# EAGLE schematic LabAccessBoard (EAGLE 9.0.1)
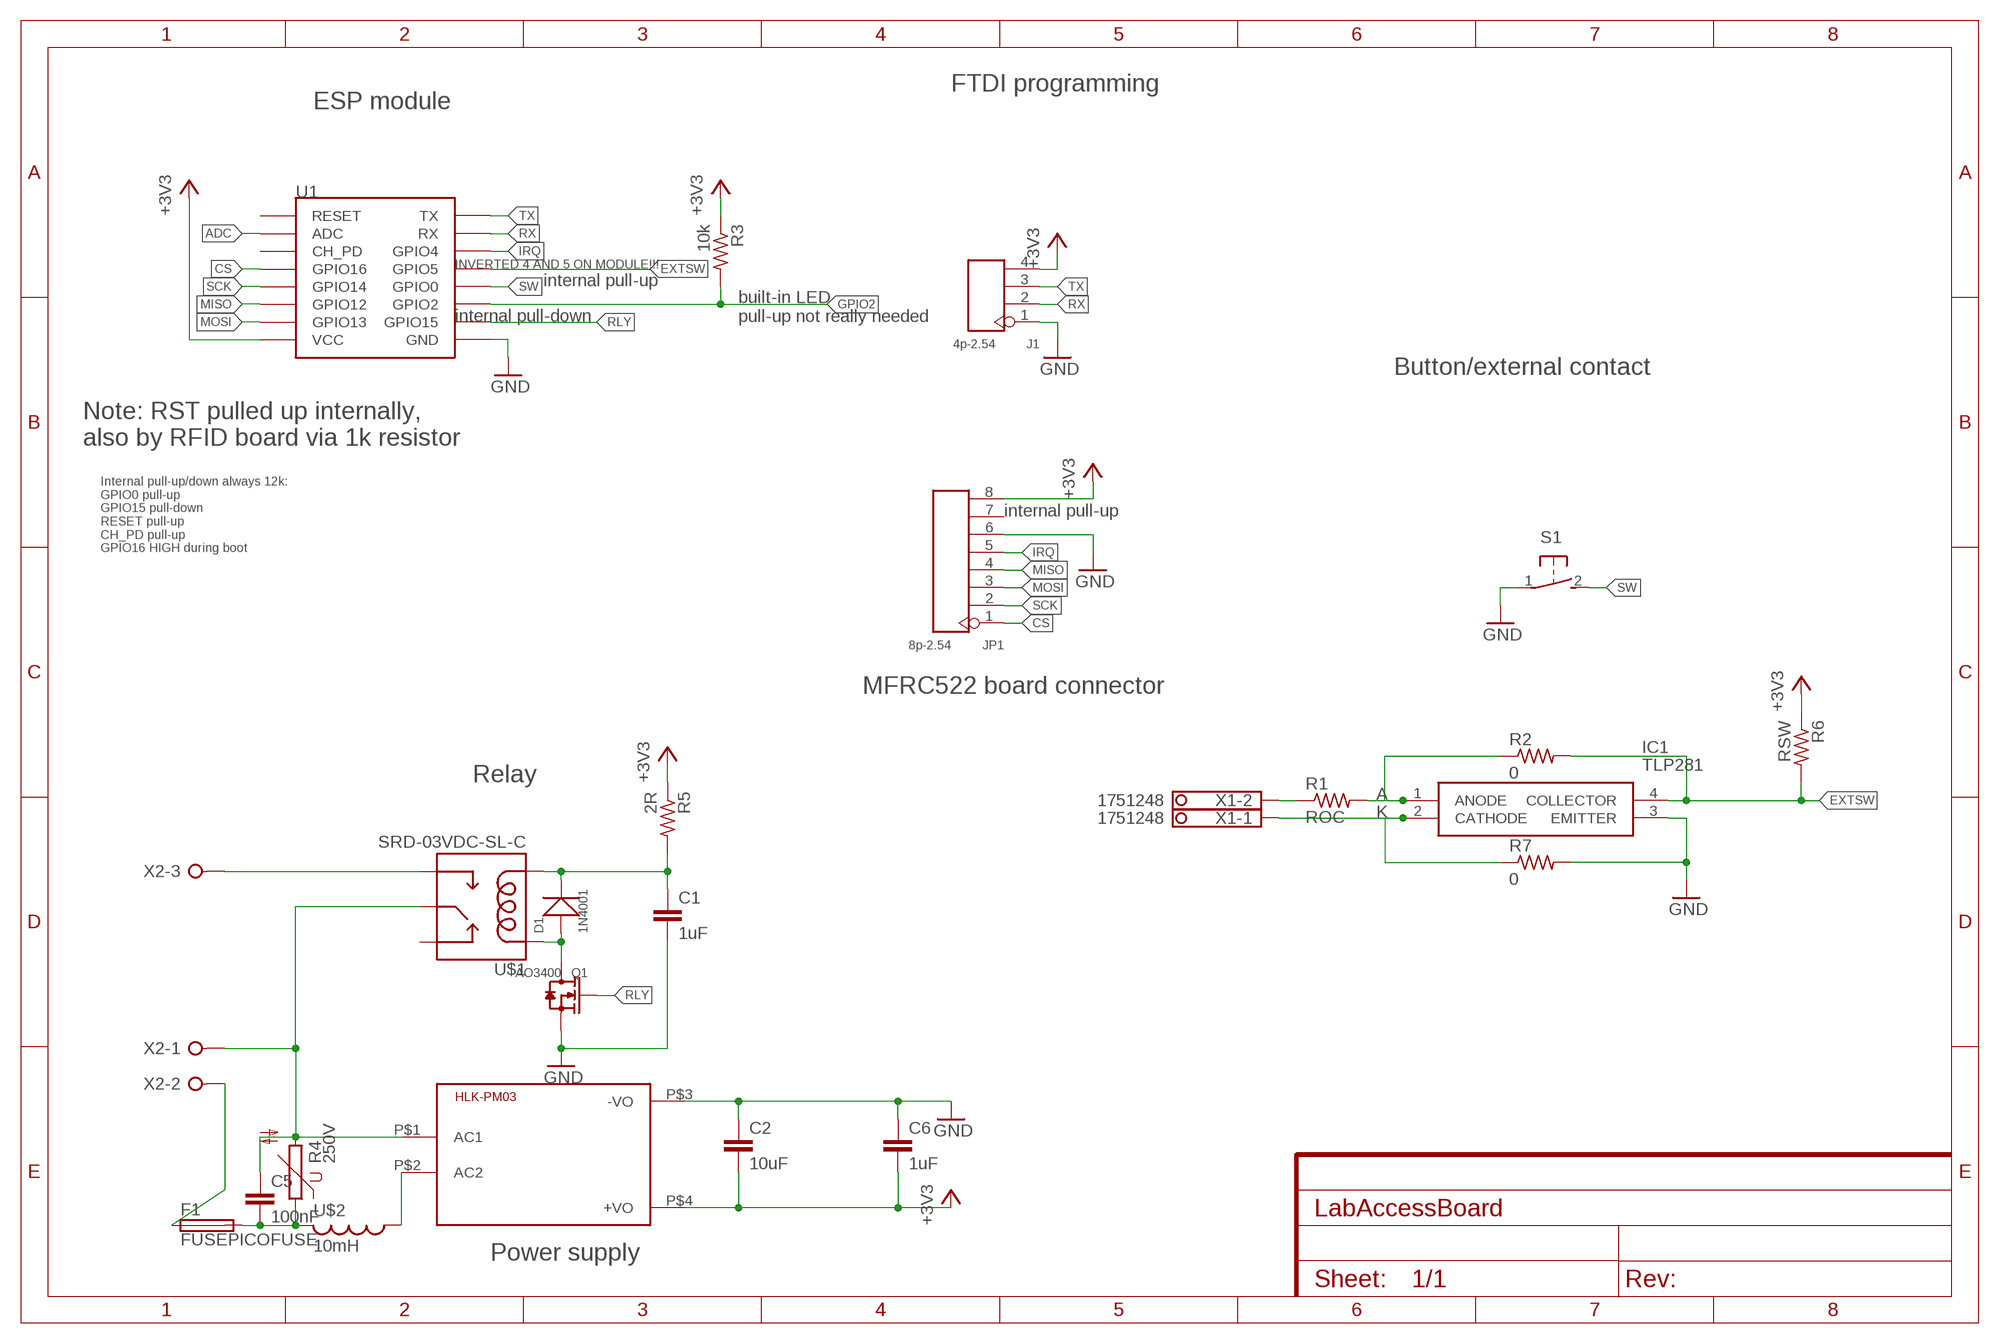
[diagram p0: schematic, sheet 1]

## Parts
C1  1uF  C-EUC0603K  [C0603K]
C2  10uF  C-EUC0805K  [C0805K]
C5  100nF  C-EU102-064X133  [C102-064X133]
C6  1uF  C-EUC0603K  [C0603K]
D1  1N4001  DIODE-GEN-PURPOSE-1KV-1A(DO-214AC)  [DO-214AC]
F1  FUSEPICOFUSE  [PICOFUSE]
HLK-PM03  HLK-PM03  HLK-PM013W  [HLK-PM01]
IC1  TLP281  TLP281(GB-TP,F)  [SOIC127P700X190-4N]
J1  4p-2.54  DIP-BLACK-MALE-HEADER-VERT(4P-2.54)  [H4-2.54]
JP1  8p-2.54  DIP-BLACK-MALE-HEADER-VERT(8P-2.54)  [H8-2.54]
Q1  AO3400  SMD-MOSFET-N-CH-60V-300MA-LOGIC-LEVEL-FET-2N7002(SOT-23)  [SOT-23]
R1  ROC  R-US_R0603  [R0603]
R2  0  R-US_R0603  [R0603]
R3  10k  R-US_R0603  [R0603]
R4  250V  S07K250  [S07K250]
R5  2R  R-US_R0603  [R0603]
R6  RSW  R-US_R0603  [R0603]
R7  0  R-US_R0603  [R0603]
S1  31-XX  [B3F-31XX]
U1  ESP12SMD  [ESP12-SMD]
U$1  SRD-03VDC-SL-C  SRD-0XVDC-SL-CSRD-06VDC-SL-C  [SRD-0XVDC-SL-C]
U$2  10mH  L-US6000-XXX-RC  [6000-XXXX-RC]
X1  1751248  [1751248]
X2  W237-3E  [W237-3E]

## Nets
+3V3: C2.2 C6.2 HLK-PM03.P$4(+VO) J1.4 JP1.8 R3.1 R5.1 R6.1 U1.VCC
A: IC1.1(ANODE) R1.2 R2.1
ADC: U1.ADC
CS: JP1.1 U1.GPIO16
EXTSW: IC1.4(COLLECTOR) R2.2 R6.2 U1.GPIO5
GND: C1.2 C2.1 C6.1 HLK-PM03.P$3(-VO) IC1.3(EMITTER) J1.1 JP1.6 Q1.2(S) R7.2 S1.1(P) U1.GND
GPIO2: R3.2 U1.GPIO2
IRQ: JP1.5 U1.GPIO4
K: IC1.2(CATHODE) R7.1 X1.1
MISO: JP1.4 U1.GPIO12
MOSI: JP1.3 U1.GPIO13
N$1: U$1.SWOPEN X2.3
N$2: C5.1 HLK-PM03.P$1(AC1) R4.2 U$1.SWCOMMON X2.1
N$3: C5.2 F1.2 R4.1 U$2.2
N$4: F1.1 X2.2
N$5: C1.1 D1.2(-) R5.2 U$1.COIL0
N$6: HLK-PM03.P$2(AC2) U$2.1
N$8: D1.1(+) Q1.3(D) U$1.COIL1
N$9: R1.1 X1.2
RLY: Q1.1(G) U1.GPIO15
RX: J1.2 U1.RXD0(RX)
SCK: JP1.2 U1.GPIO14
SW: S1.2(S) U1.GPIO0
TX: J1.3 U1.TXD0(TX)
Unconnected: JP1.7 U1.CH_PD U1.RESET U$1.SWCLOSED(SWCLOSE)

## Notes on the sheet
- FTDI programming
- ESP module
- INVERTED 4 AND 5 ON MODULE!!!
- internal pull-up
- internal pull-down
- built-in LED
  pull-up not really needed
- Button/external contact
- Note: RST pulled up internally,
  also by RFID board via 1k resistor
- internal pull-up
- Internal pull-up/down always 12k:
  GPIO0 pull-up
  GPIO15 pull-down
  RESET pull-up
  CH_PD pull-up
  GPIO16 HIGH during boot
- MFRC522 board connector
- Relay
- Power supply

## Library data of the parts
C1 C2 C5 C6 = rcl:C-EU: CAPACITOR, European symbol; SPICEPREFIX: C
D1 = Seeed-Diode:DIODE-GEN-PURPOSE-1KV-1A(DO-214AC): 304010013; MPN: 1N4007; VALUE: 1N4007
F1 = fuse:FUSE: Fuse; OC_FARNELL: unknown; OC_NEWARK: unknown
HLK-PM03 = HLK-PM01:HLK-PM01: Hi-Link Power Supply HLK-PM01 3W Author: Ahmed Said <https://github.com/AhmedSaid/EAGLELibraries>
IC1 = TLP281(GB-TP_F):TLP281(GB-TP,F): PROGRAMMABLE CONTROLLERS AC/DC-INPUT MODULE PC CARD MODEM(PCMCIA) Source: Datasheet <https://toshiba.semicon-storage.com/info/docget.jsp?did=16753&prodName=TLP281>; ARROW_PART_NUMBER: TLP281(GB-TP,F); DESCRIPTION: PROGRAMMABLE CONTROLLERS AC/DC-INPUT MODULE PC CARD MODEM(PCMCIA); HEIGHT: 1.9mm; MANUFACTURER_NAME: Toshiba; MANUFACTURER_PART_NUMBER: TLP281(GB-TP,F)
J1 = Seeed-Connector:DIP-BLACK-MALE-HEADER-VERT(4P-2.54): 320020017; MPN: P125-1104A0BS116A1
JP1 = Seeed-Connector:DIP-BLACK-MALE-HEADER-VERT(8P-2.54): 320020080; MPN: P125-1108A1BS116A1
Q1 = Seeed-Transistor:SMD-MOSFET-N-CH-60V-300MA-LOGIC-LEVEL-FET-2N7002(SOT-23): 305030028; MPN: 2N7002,215; VALUE: 2N7002
R1-R3 R5-R7 = resistor:R-US_: RESISTOR, American symbol
R4 = varistor:S07K250: VARISTOR
S1 = switch-omron:31-XX: OMRON SWITCH; MPN: B3F-3100; OC_FARNELL: 959704; OC_NEWARK: 36M3582
U1 = esp8266modules:ESP12: ESP8266 Wifi module 12
U$1 = SRD-0XVDC-SL-C:SRD-0XVDC-SL-C: SRD-05VDC-SL-C SRD-06VDC-SL-C Compatible with: SONGLE Relays SHUN YU JQX-3F other same relays Author: Ahmed Said <https://github.com/AhmedSaid/EAGLELibraries>
U$2 = rcl:L-US: INDUCTOR, American symbol; SPICEPREFIX: L
X1 = con-phoenix-350:1751248: MKDS 1/ 2-3,5 Printklemme Nennstrom: 10 A Bemessungsspannung: 160 V Raster: 3,5 mm Polzahl: 2 Montageart: Löten Anschlussart: Schraubanschluss Anschlussrichtung vom Leiter zur Platine: 0° Source: http://eshop.phoenixcontact.com .. 1751248.pdf; OC_FARNELL: unknown; OC_NEWARK: unknown
X2 = con-wago-508:W237-3E: WAGO SREW CLAMP; OC_FARNELL: unknown; OC_NEWARK: unknown